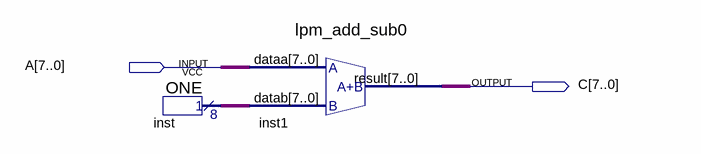
[diagram p0: schematic sheet]
// Quartus schematic INC.bdf as structural Verilog: 2 symbols, 2 pins
module INC (
  input  [7:0] A,
  output [7:0] C
);

  wire [7:0] inst_result;

  ONE inst (.result(inst_result));
  lpm_add_sub0 inst1 (.dataa(A), .datab(inst_result), .result(C));
endmodule
